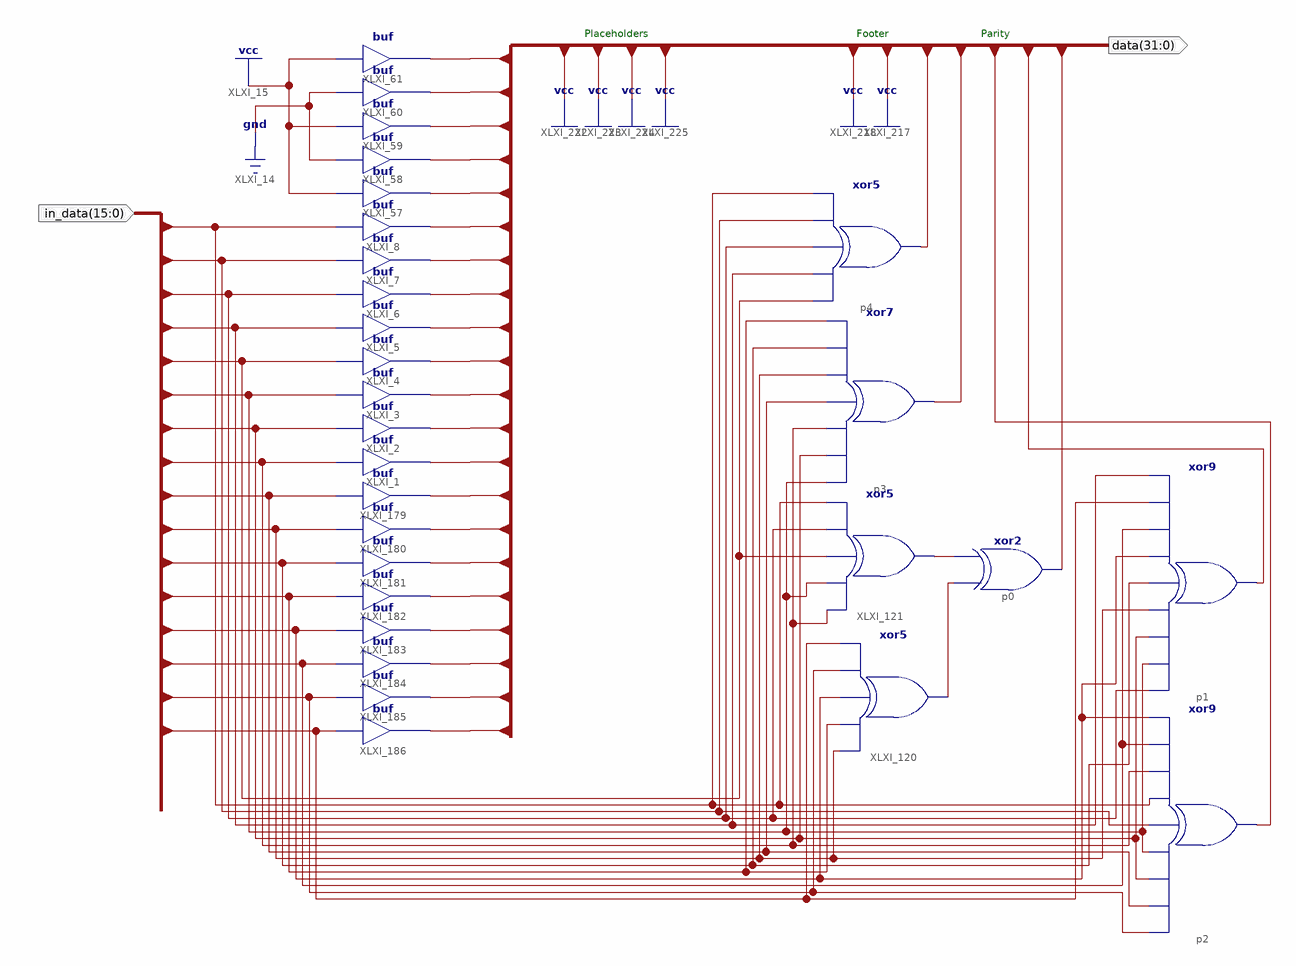
[diagram p0: schematic sheet 1]
// Xilinx ISE schematic hamming_enc.sch (spartan6) as structural Verilog: 28 symbols, 2 ports
module hamming_enc (
  input  [15:0] in_data,
  output [31:0] data
);

  wire XLXN_96, XLXN_97;

  buf XLXI_1 (data[18], in_data[8]);
  buf XLXI_57 (data[27], 1'b1);
  buf XLXI_58 (data[28], 1'b0);
  buf XLXI_59 (data[29], 1'b1);
  buf XLXI_60 (data[30], 1'b0);
  buf XLXI_61 (data[31], 1'b1);
  xor p1 (data[7], in_data[13], in_data[10], in_data[9], in_data[6], in_data[5], in_data[3], in_data[2], in_data[0], in_data[12]);
  xor p2 (data[9], in_data[1], in_data[7], in_data[9], in_data[10], in_data[14], in_data[15], in_data[8], in_data[2], in_data[3]);
  xor p3 (data[13], in_data[10], in_data[9], in_data[8], in_data[7], in_data[6], in_data[5], in_data[4]);
  xor p4 (data[21], in_data[11], in_data[12], in_data[13], in_data[14], in_data[15]);
  buf XLXI_2 (data[19], in_data[9]);
  buf XLXI_3 (data[20], in_data[10]);
  buf XLXI_4 (data[22], in_data[11]);
  buf XLXI_5 (data[23], in_data[12]);
  buf XLXI_6 (data[24], in_data[13]);
  buf XLXI_7 (data[25], in_data[14]);
  buf XLXI_8 (data[26], in_data[15]);
  buf XLXI_179 (data[17], in_data[7]);
  buf XLXI_180 (data[16], in_data[6]);
  buf XLXI_181 (data[15], in_data[5]);
  buf XLXI_182 (data[14], in_data[4]);
  buf XLXI_183 (data[12], in_data[3]);
  buf XLXI_184 (data[11], in_data[2]);
  buf XLXI_185 (data[10], in_data[1]);
  buf XLXI_186 (data[8], in_data[0]);
  xor XLXI_121 (XLXN_96, in_data[8], in_data[10], in_data[11], in_data[13], in_data[15]);
  xor p0 (data[6], XLXN_97, XLXN_96);
  xor XLXI_120 (XLXN_97, in_data[6], in_data[4], in_data[3], in_data[1], in_data[0]);

  assign data[5:0] = {6{1'b1}};

  // Notes on the sheet:
  //   Placeholders
  //   Footer
  //   Parity
endmodule
